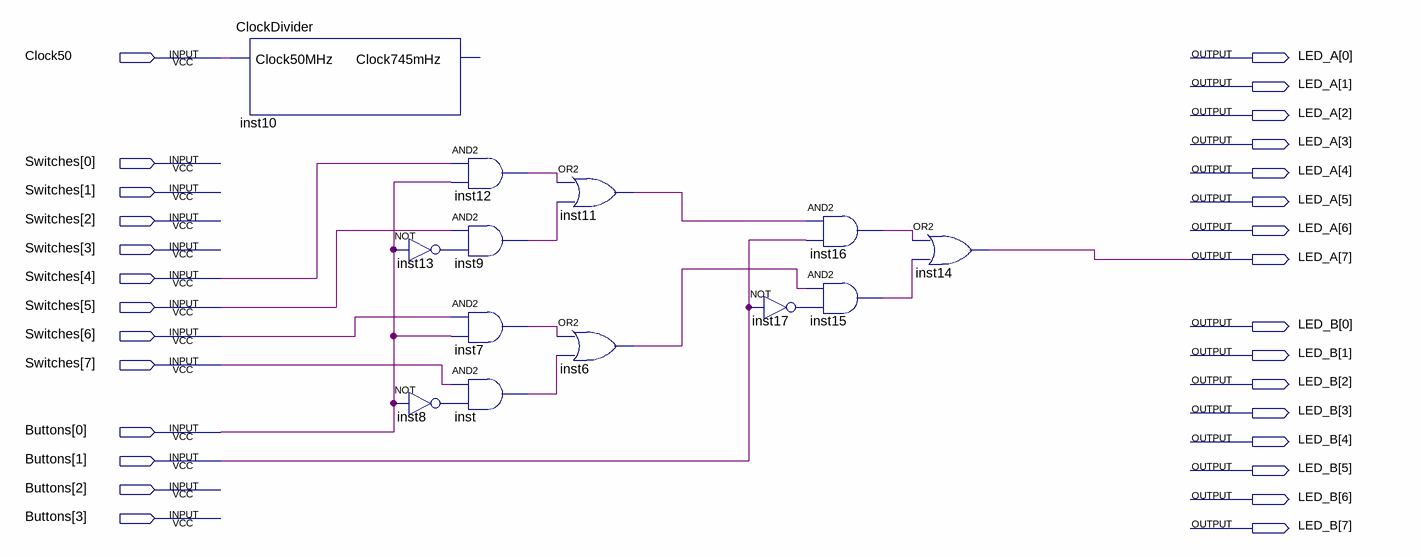
[diagram p0: schematic sheet]
// Quartus schematic 2BitMultiplexer.bdf as structural Verilog: 13 symbols, 29 pins
module \2BitMultiplexer  (
  input  Clock50,
  input  [7:0] Switches,
  input  [3:0] Buttons,
  output [7:0] LED_A,
  output [7:0] LED_B
);

  wire inst6_out, inst7_out, inst8_out, inst9_out, inst11_out, inst12_out, inst13_out, inst15_out,
       inst16_out, inst17_out, inst_out;

  ClockDivider inst10 (.Clock50MHz(Clock50));  // open: Clock745mHz
  not inst13 (inst13_out, Buttons[0]);
  not inst8 (inst8_out, Buttons[0]);
  and inst12 (inst12_out, Switches[4], Buttons[0]);
  and inst9 (inst9_out, Switches[5], inst13_out);
  and inst7 (inst7_out, Switches[6], Buttons[0]);
  and inst (inst_out, Switches[7], inst8_out);
  or inst11 (inst11_out, inst12_out, inst9_out);
  or inst6 (inst6_out, inst7_out, inst_out);
  not inst17 (inst17_out, Buttons[1]);
  and inst16 (inst16_out, inst11_out, Buttons[1]);
  and inst15 (inst15_out, inst6_out, inst17_out);
  or inst14 (LED_A[7], inst16_out, inst15_out);
endmodule
